# EAGLE schematic zx_kit (EAGLE 6.5.0)
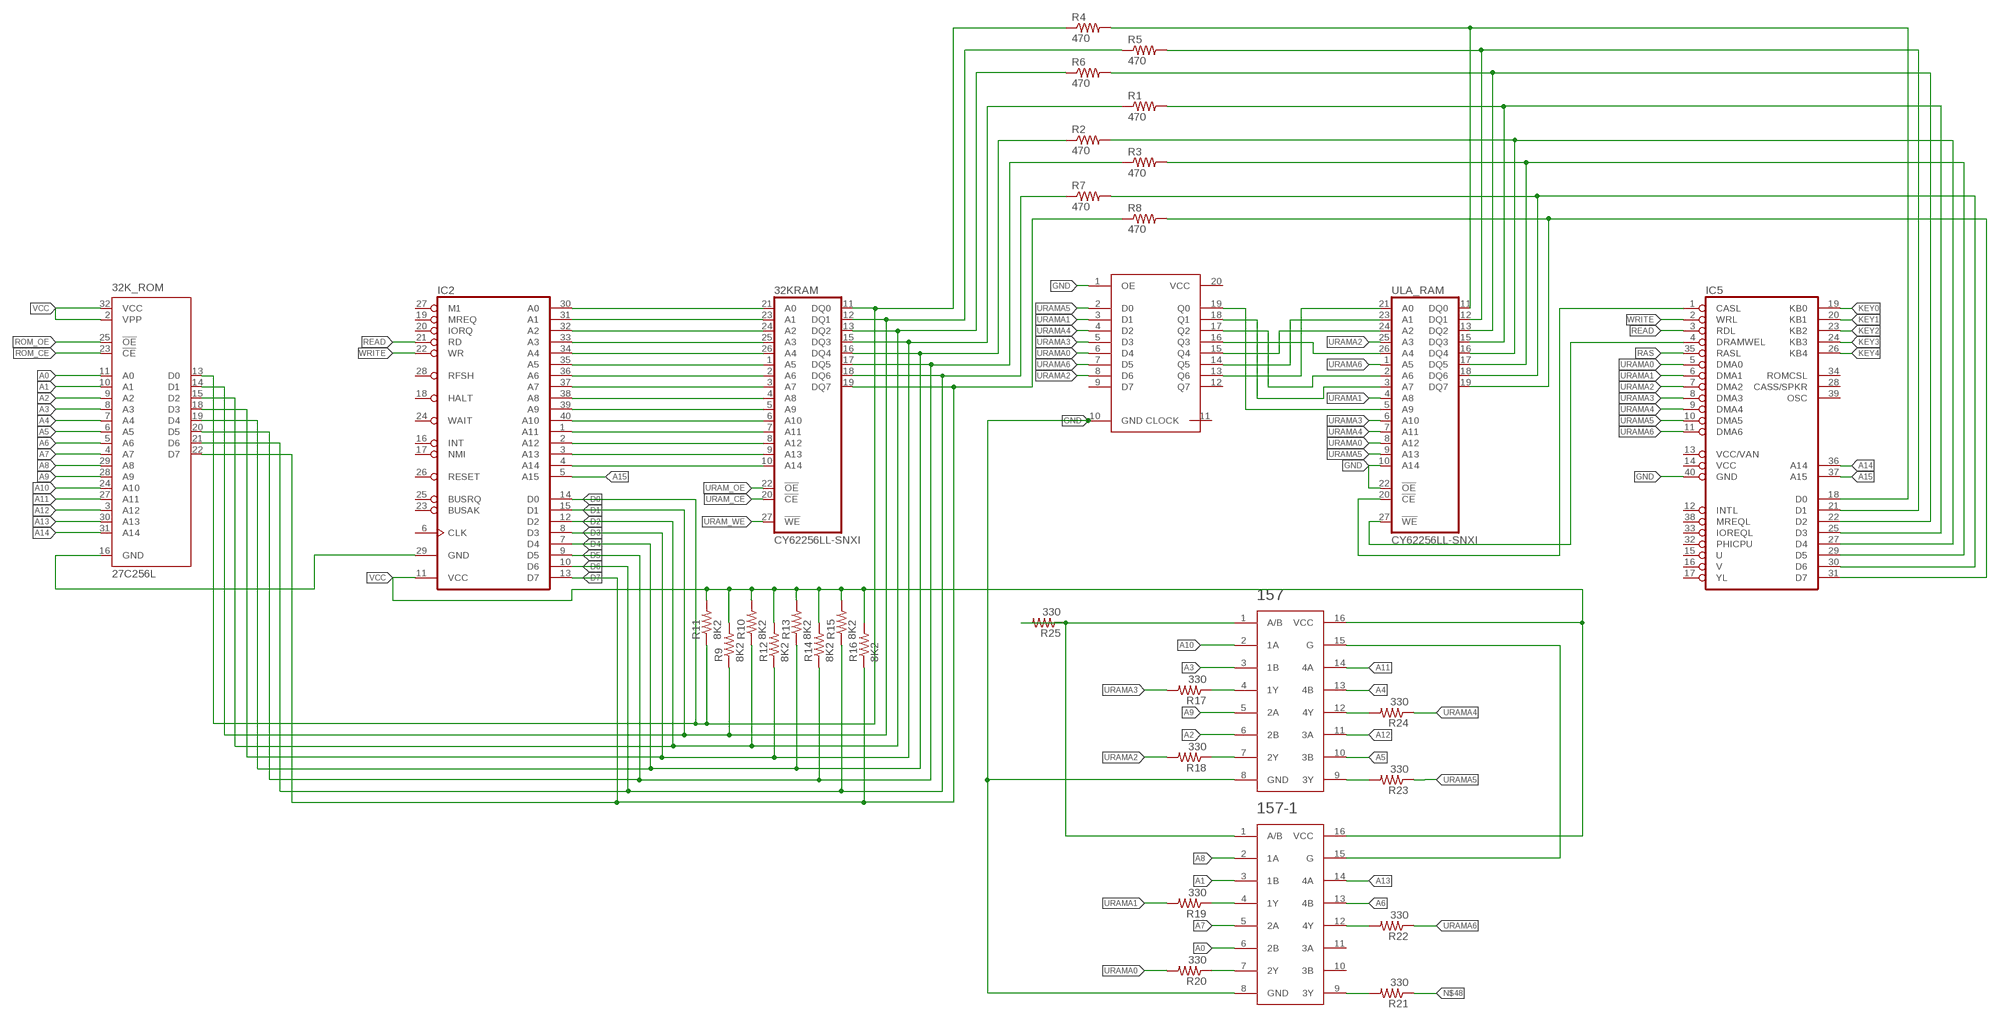
[diagram p0: schematic, sheet 1]

## Parts
32K_ROM  27C256L  [PLCC-32]
32KRAM  CY62256LL-SNXI  [SOJ28/3]
157  SN74HC157D  [SO16]
157-1  SN74HC157D  [SO16]
IC2  Z80CPU  [DIL40]
IC5  ZXULA  [DIL40]
R1  470  R-US_M0805  [M0805]
R2  470  R-US_M0805  [M0805]
R3  470  R-US_M0805  [M0805]
R4  470  R-US_M0805  [M0805]
R5  470  R-US_M0805  [M0805]
R6  470  R-US_M0805  [M0805]
R7  470  R-US_M0805  [M0805]
R8  470  R-US_M0805  [M0805]
R9  8K2  R-US_M0805  [M0805]
R10  8K2  R-US_M0805  [M0805]
R11  8K2  R-US_M0805  [M0805]
R12  8K2  R-US_M0805  [M0805]
R13  8K2  R-US_M0805  [M0805]
R14  8K2  R-US_M0805  [M0805]
R15  8K2  R-US_M0805  [M0805]
R16  8K2  R-US_M0805  [M0805]
R17  330  R-US_M0805  [M0805]
R18  330  R-US_M0805  [M0805]
R19  330  R-US_M0805  [M0805]
R20  330  R-US_M0805  [M0805]
R21  330  R-US_M0805  [M0805]
R22  330  R-US_M0805  [M0805]
R23  330  R-US_M0805  [M0805]
R24  330  R-US_M0805  [M0805]
R25  330  R-US_M0805  [M0805]
U$1  MC74HC574A  [SO20W]
ULA_RAM  CY62256LL-SNXI  [SOJ28/3]

## Nets
A0: 32K_ROM.11(A0) 32KRAM.21(A0) 157-1.6(2B) IC2.30(A0)
A1: 32K_ROM.10(A1) 32KRAM.23(A1) 157-1.3(1B) IC2.31(A1)
A2: 32K_ROM.9(A2) 32KRAM.24(A2) 157.6(2B) IC2.32(A2)
A3: 32K_ROM.8(A3) 32KRAM.25(A3) 157.3(1B) IC2.33(A3)
A4: 32K_ROM.7(A4) 32KRAM.26(A4) 157.13(4B) IC2.34(A4)
A5: 32K_ROM.6(A5) 32KRAM.1(A5) 157.10(3B) IC2.35(A5)
A6: 32K_ROM.5(A6) 32KRAM.2(A6) 157-1.13(4B) IC2.36(A6)
A7: 32K_ROM.4(A7) 32KRAM.3(A7) 157-1.5(2A) IC2.37(A7)
A8: 32K_ROM.29(A8) 32KRAM.4(A8) 157-1.2(1A) IC2.38(A8)
A9: 32K_ROM.28(A9) 32KRAM.5(A9) 157.5(2A) IC2.39(A9)
A10: 32K_ROM.24(A10) 32KRAM.6(A10) 157.2(1A) IC2.40(A10)
A11: 32K_ROM.27(A11) 32KRAM.7(A11) 157.14(4A) IC2.1(A11)
A12: 32K_ROM.3(A12) 32KRAM.8(A12) 157.11(3A) IC2.2(A12)
A13: 32K_ROM.30(A13) 32KRAM.9(A13) 157-1.14(4A) IC2.3(A13)
A14: 32K_ROM.31(A14) 32KRAM.10(A14) IC2.4(A14) IC5.36(A14)
A15: IC2.5(A15) IC5.37(A15)
D0: 32K_ROM.13(D0) 32KRAM.11(DQ0) IC2.14(D0) R4.1 R11.1
D1: 32K_ROM.14(D1) 32KRAM.12(DQ1) IC2.15(D1) R5.1 R9.1
D2: 32K_ROM.15(D2) 32KRAM.13(DQ2) IC2.12(D2) R6.1 R10.1
D3: 32K_ROM.18(D3) 32KRAM.15(DQ3) IC2.8(D3) R1.1 R12.1
D4: 32K_ROM.19(D4) 32KRAM.16(DQ4) IC2.7(D4) R2.1 R13.1
D5: 32K_ROM.20(D5) 32KRAM.17(DQ5) IC2.9(D5) R3.1 R14.1
D6: 32K_ROM.21(D6) 32KRAM.18(DQ6) IC2.10(D6) R7.1 R15.1
D7: 32K_ROM.22(D7) 32KRAM.19(DQ7) IC2.13(D7) R8.1 R16.1
GND: 32K_ROM.16(GND) 157-1.8(GND) 157.8(GND) IC2.29(GND) IC5.40(GND) U$1.1(OE) ULA_RAM.10(A14) ULA_RAM.22(!OE)
KEY0: IC5.19(KB0)
KEY1: IC5.20(KB1)
KEY2: IC5.23(KB2)
KEY3: IC5.24(KB3)
KEY4: IC5.26(KB4)
N$1: 157-1.16(VCC) 157.16(VCC) IC2.11(VCC) R9.2 R10.2 R11.2 R12.2 R13.2 R14.2 R15.2 R16.2
N$2: IC5.18(D0) R4.2 ULA_RAM.11(DQ0)
N$3: IC5.21(D1) R5.2 ULA_RAM.12(DQ1)
N$4: IC5.22(D2) R6.2 ULA_RAM.13(DQ2)
N$5: IC5.25(D3) R1.2 ULA_RAM.15(DQ3)
N$6: IC5.27(D4) R2.2 ULA_RAM.16(DQ4)
N$7: IC5.29(D5) R3.2 ULA_RAM.17(DQ5)
N$8: IC5.30(D6) R7.2 ULA_RAM.18(DQ6)
N$9: IC5.31(D7) R8.2 ULA_RAM.19(DQ7)
N$10: U$1.13(Q6) ULA_RAM.21(A0)
N$11: U$1.14(Q5) ULA_RAM.23(A1)
N$12: U$1.15(Q4) ULA_RAM.24(A2)
N$13: U$1.16(Q3) ULA_RAM.26(A4)
N$14: U$1.17(Q2) ULA_RAM.2(A6)
N$15: 157.4(1Y) R17.1
N$16: U$1.19(Q0) ULA_RAM.5(A9)
N$17: 157.7(2Y) R18.1
N$18: IC5.1(CASL) ULA_RAM.20(!CE)
N$19: 157-1.4(1Y) R19.1
N$20: 157-1.7(2Y) R20.1
N$21: IC5.4(DRAMWEL) ULA_RAM.27(!WE)
N$22: 157-1.9(3Y) R21.2
N$25: 157-1.12(4Y) R22.2
N$28: 157-1.15(G) 157.15(G)
N$31: 157-1.1(A/B) 157.1(A/B) R25.1
N$34: 157.9(3Y) R23.2
N$37: 157.12(4Y) R24.2
N$48: R21.1
N$54: R25.2
RAS: IC5.35(RASL)
READ: IC2.21(RD) IC5.3(RDL)
ROM_CE: 32K_ROM.23(!CE)
ROM_OE: 32K_ROM.25(!OE)
URAM_CE: 32KRAM.20(!CE)
URAM_OE: 32KRAM.22(!OE)
URAM_WE: 32KRAM.27(!WE)
URAMA0: IC5.5(DMA0) R20.2 U$1.6(D4) ULA_RAM.8(A12)
URAMA1: IC5.6(DMA1) R19.2 U$1.3(D1) U$1.18(Q1) ULA_RAM.3(A7) ULA_RAM.4(A8)
URAMA2: IC5.7(DMA2) R18.2 U$1.8(D6) ULA_RAM.25(A3)
URAMA3: IC5.8(DMA3) R17.2 U$1.5(D3) ULA_RAM.6(A10)
URAMA4: IC5.9(DMA4) R24.1 U$1.4(D2) ULA_RAM.7(A11)
URAMA5: IC5.10(DMA5) R23.1 U$1.2(D0) ULA_RAM.9(A13)
URAMA6: IC5.11(DMA6) R22.1 U$1.7(D5) ULA_RAM.1(A5)
VCC: 32K_ROM.2(VPP) 32K_ROM.32(VCC)
WRITE: IC2.22(WR) IC5.2(WRL)
Unconnected: 157-1.10(3B) 157-1.11(3A) IC2.6(CLK) IC2.16(INT) IC2.17(NMI) IC2.18(HALT) IC2.19(MREQ) IC2.20(IORQ) IC2.23(BUSAK) IC2.24(WAIT) IC2.25(BUSRQ) IC2.26(RESET) IC2.27(M1) IC2.28(RFSH) IC5.12(INTL) IC5.13(VCC/VAN) IC5.14(VCC) IC5.15(U) IC5.16(V) IC5.17(YL) IC5.28(CASS/SPKR) IC5.32(PHICPU) IC5.33(IOREQL) IC5.34(ROMCSL) IC5.38(MREQL) IC5.39(OSC) U$1.9(D7) U$1.10(GND) U$1.11(CLOCK) U$1.12(Q7) U$1.20(VCC)

## Power pins joined to a net without a drawn wire
GND: 32KRAM.14(GND) ULA_RAM.14(GND)
VCC: 32KRAM.28(VCC) ULA_RAM.28(VCC)

## Library data of the parts
32K_ROM = microchip:27*256: CMOS EPROM 256 K (32 K x 8), low voltage; MPN: AT27C256R-70JU; OC_FARNELL: 1095779; OC_NEWARK: 96K6554
32KRAM ULA_RAM = zx_SRAM:CY62256LL-?*: 256K (32K x 8) CMOS-Static RAM Source: http://download.cypress.com.edgesuite.net/design_resources/datasheets/contents/cy62256_8.pdf
157 157-1 = zx_ULA:SN74HC157D: Multiplexer used to select address lines of video RAM
IC2 = zilog:Z80CPU: Z80 FAMILY DEVICE
IC5 = zx_ULA:ZXULA: ZX Spectrum Custom ULA
R1-R25 = resistor:R-US_: RESISTOR, American symbol
U$1 = zx_ULA:MC74HC574A: Octal 3-State Noninverting D Flip Flop